# EAGLE design PIDDYBOT_V1_32U4 (EAGLE 8.3.0)
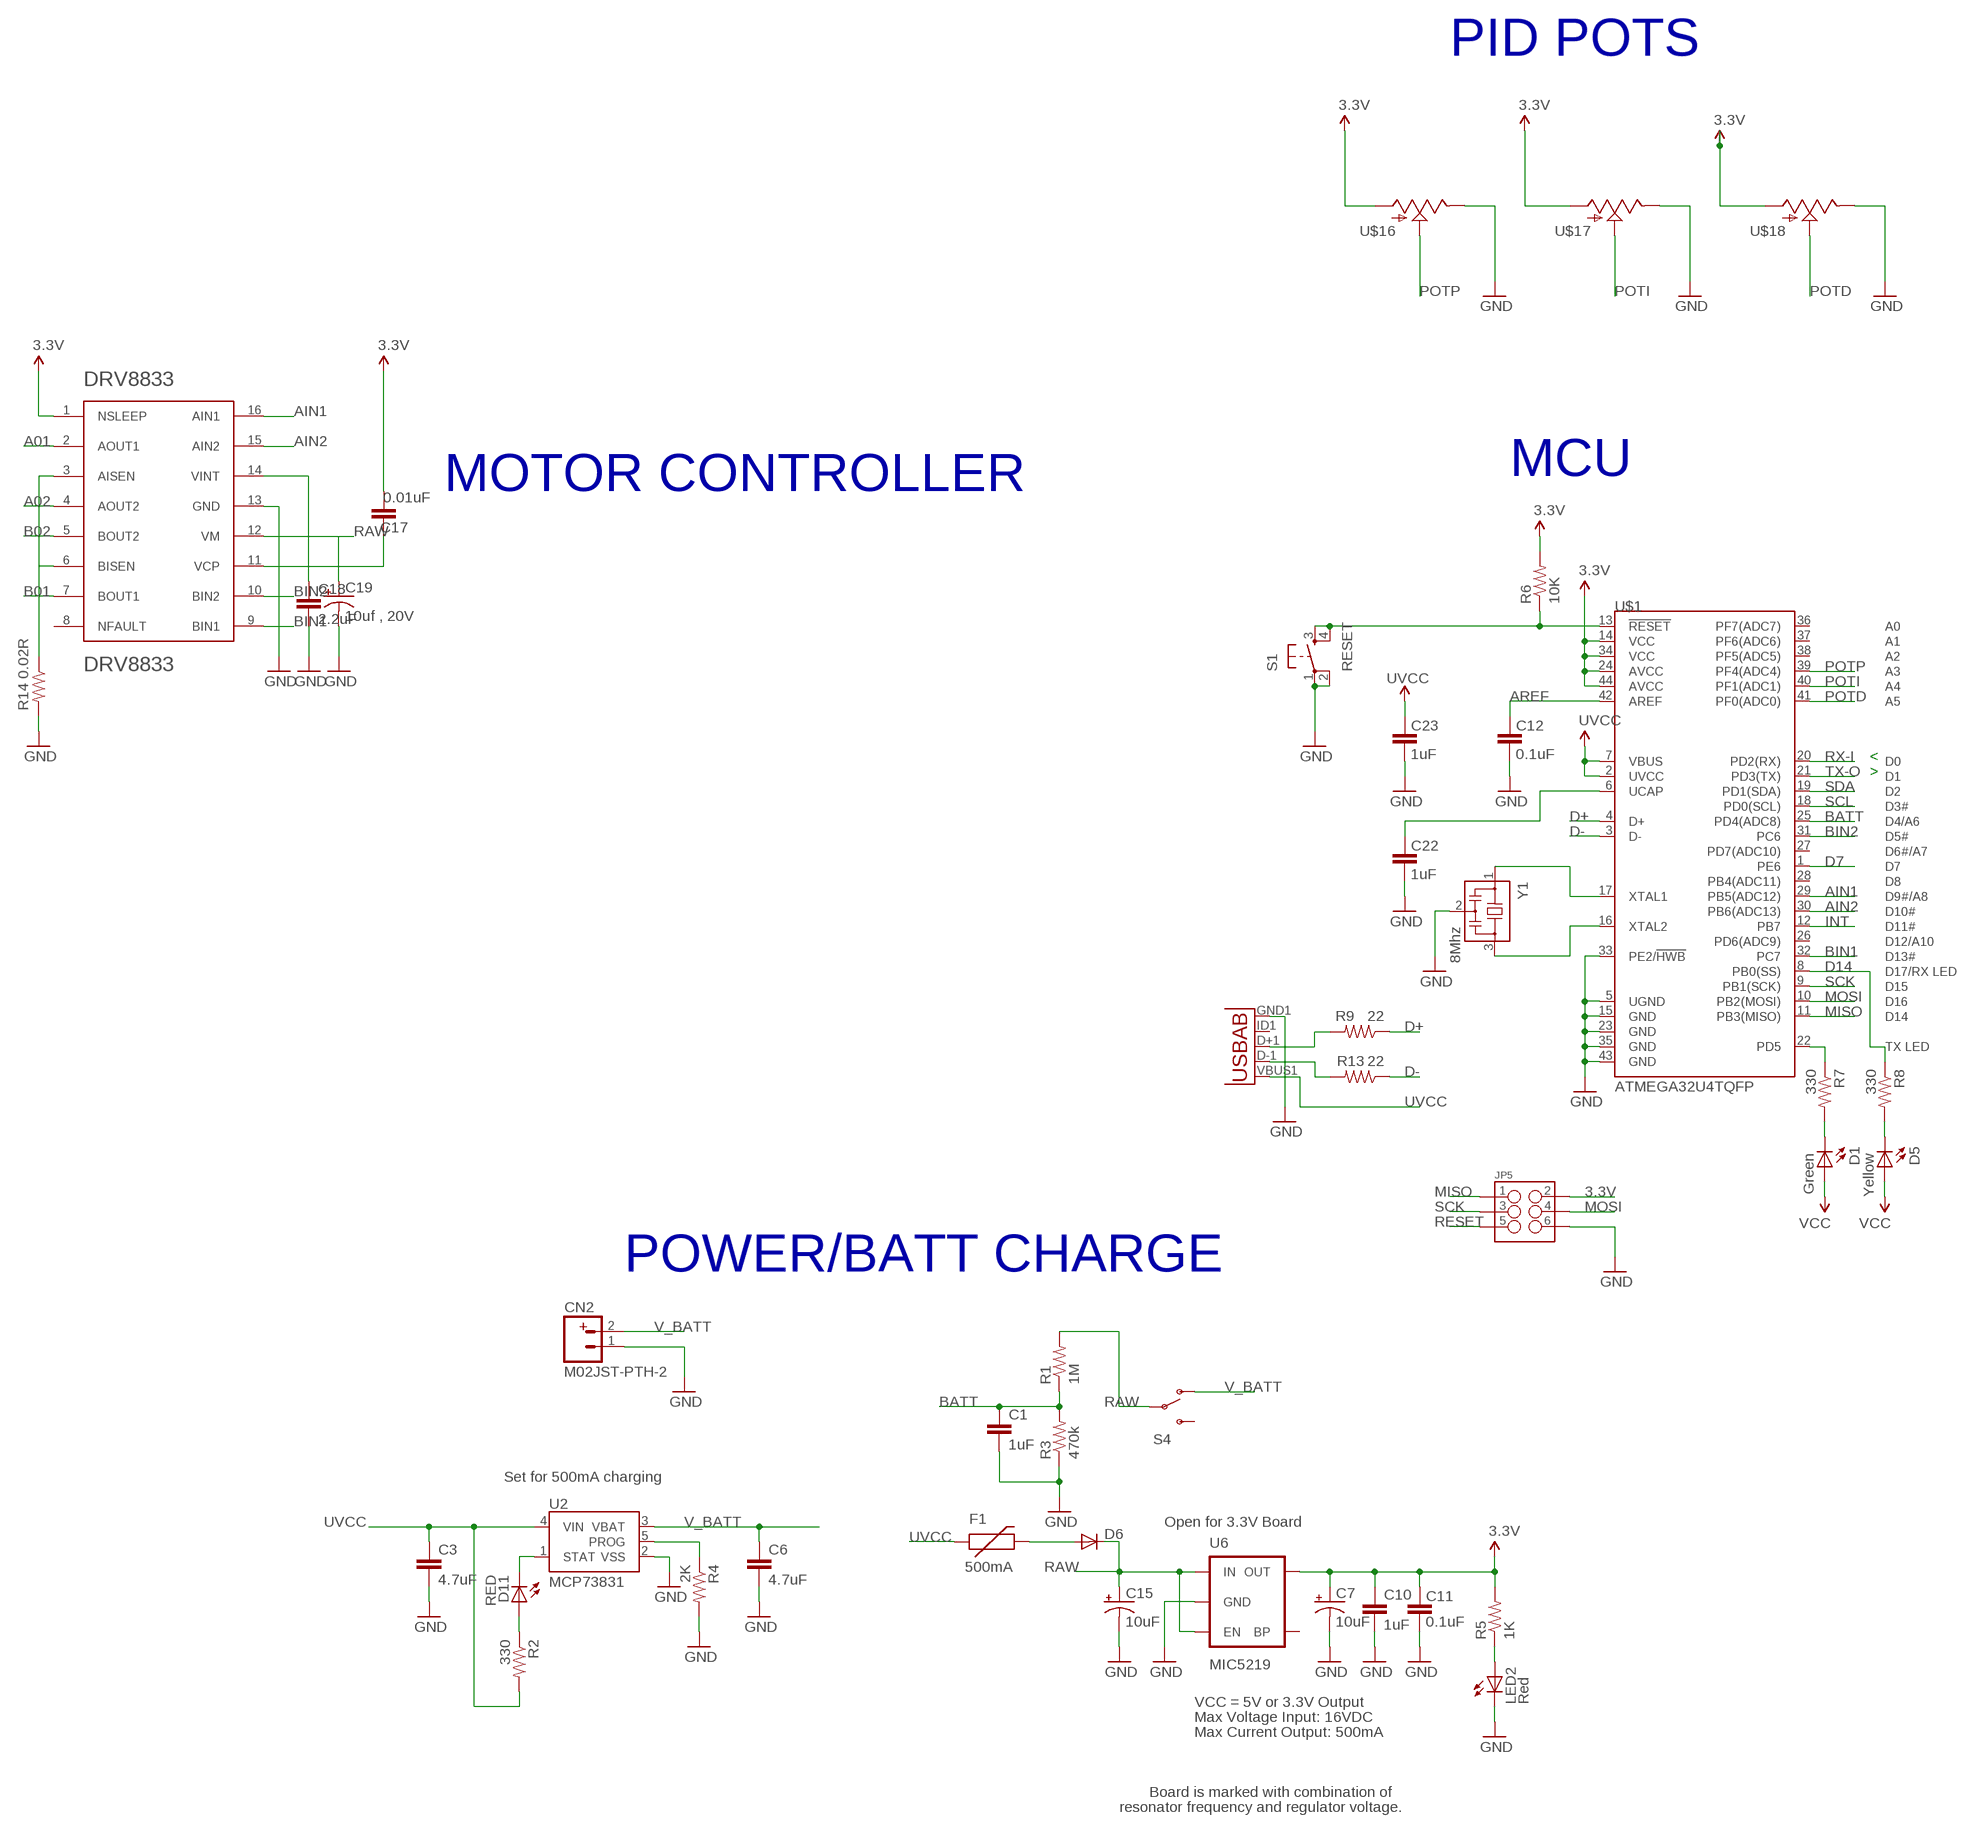
[diagram p0: schematic, sheet 1, part 1 of 2]
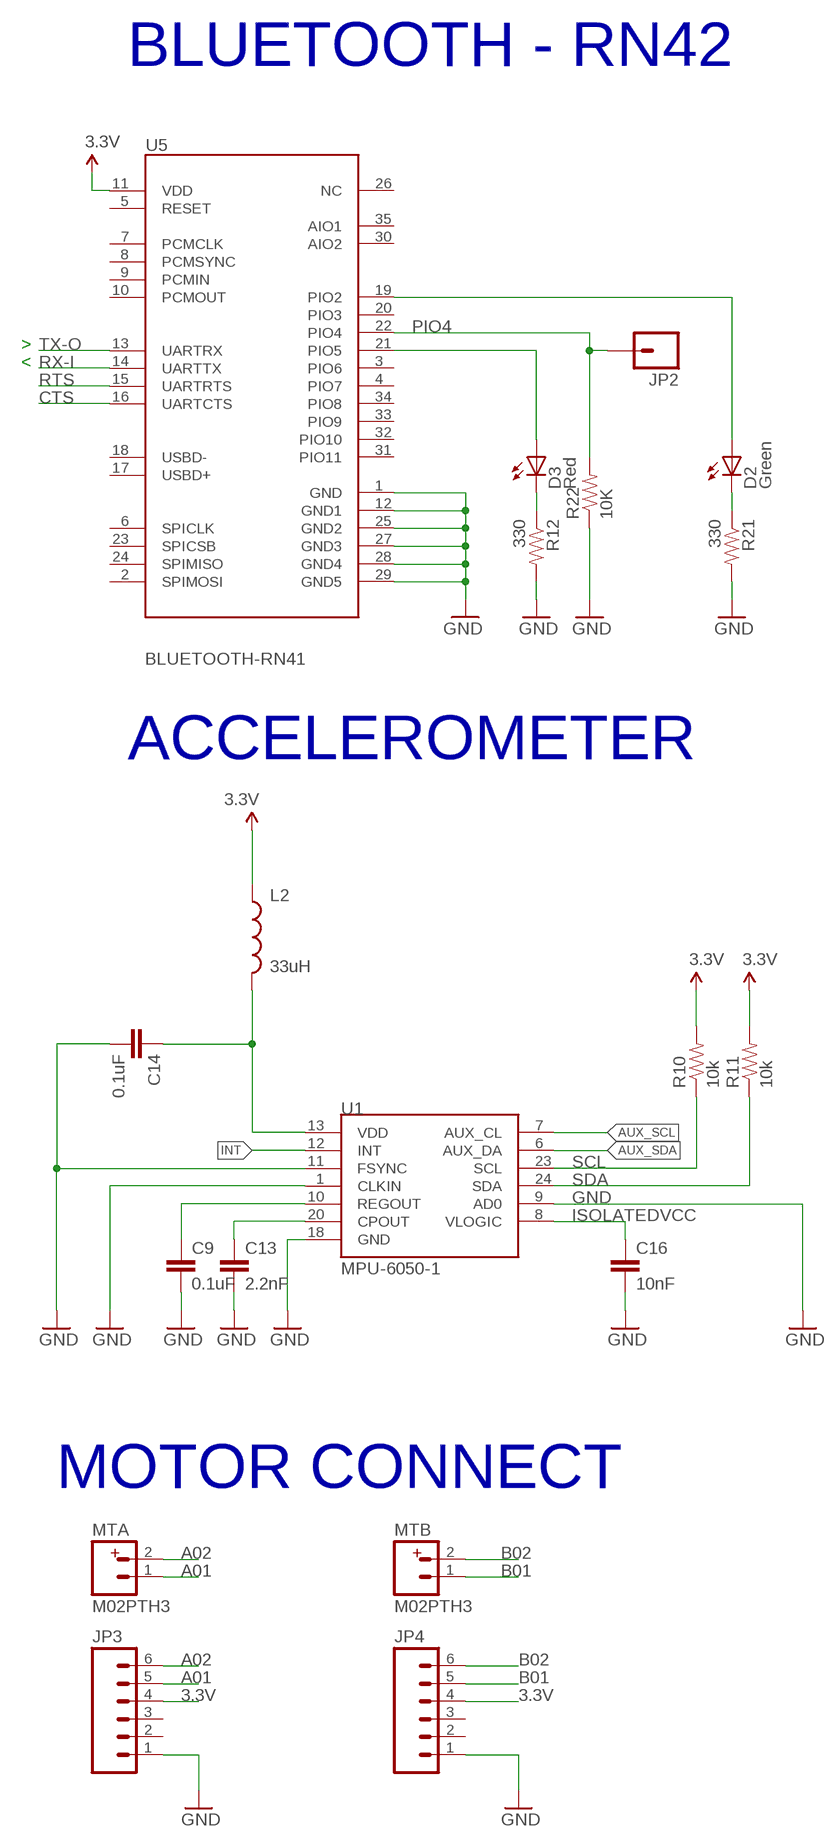
[diagram p1: schematic, sheet 1, part 2 of 2]

## Parts
C1  1uF  CAP0603-CAP  [0603-CAP]
C3  4.7uF  CAP0603-CAP  [0603-CAP]
C6  4.7uF  CAP0603-CAP  [0603-CAP]
C7  10uF  CAP_POL1206  [EIA3216]
C9  0.1uF  CAP0603-CAP  [0603-CAP]
C10  1uF  CAP0603-CAP  [0603-CAP]
C11  0.1uF  CAP0603-CAP  [0603-CAP]
C12  0.1uF  CAP0603-CAP  [0603-CAP]
C13  2.2nF  CAP0603-CAP  [0603-CAP]
C14  0.1uF  CAP0603-CAP  [0603-CAP]
C15  10uF  CAP_POL1206  [EIA3216]
C16  10nF  CAP0603-CAP  [0603-CAP]
C17  0.01uF  CAP0603-CAP  [0603-CAP]
C18  2.2uF  CAP0603-CAP  [0603-CAP]
C19  10uf , 20V  CAP_POL3528  [EIA3528]
C22  1uF  CAP0603-CAP  [0603-CAP]
C23  1uF  CAP0603-CAP  [0603-CAP]
CN2  M02JST-PTH-2  [JST-2-PTH]
D1  Green  LED0603  [LED-0603]
D2  Green  LED0603  [LED-0603]
D3  Red  LED0603  [LED-0603]
D5  Yellow  LED0603  [LED-0603]
D6  DIODESOD  [SOD-323]
D11  RED  LED0603  [LED-0603]
DRV8833PWP1  DRV8833  [SOP65P640X120-17N]
F1  500mA  PTCSMD  [PTC-1206]
JP2  M01SMDNS  [1X01NS]
JP3  M06SMD-1MM  [1X06-1MM]
JP4  M06SMD-1MM  [1X06-1MM]
JP5  M03X2NO_SILK  [2X3-NS]
L2  33uH  INDUCTOR0402  [C0402]
LED2  Red  LED0603  [LED-0603]
MTA  M02PTH3  [1X02_LONGPADS]
MTB  M02PTH3  [1X02_LONGPADS]
R1  1M  RESISTOR0603-RES  [0603-RES]
R2  330  RESISTOR0603-RES  [0603-RES]
R3  470k  RESISTOR0603-RES  [0603-RES]
R4  2K  RESISTOR0603-RES  [0603-RES]
R5  1K  RESISTOR0603-RES  [0603-RES]
R6  10K  RESISTOR0603-RES  [0603-RES]
R7  330  RESISTOR0603-RES  [0603-RES]
R8  330  RESISTOR0603-RES  [0603-RES]
R9  22  RESISTOR0603-RES  [0603-RES]
R10  10k  RESISTOR0603-RES  [0603-RES]
R11  10k  RESISTOR0603-RES  [0603-RES]
R12  330  RESISTOR0603-RES  [0603-RES]
R13  22  RESISTOR0603-RES  [0603-RES]
R14  0.02R  RESISTOR0603-RES  [0603-RES]
R21  330  RESISTOR0603-RES  [0603-RES]
R22  10K  RESISTOR0603-RES  [0603-RES]
S1  RESET  TAC_SWITCHSMD  [TACTILE_SWITCH_SMD]
S4  SWITCH-SPDTPTH  [SWITCH-SPDT]
U1  MPU-6050-1  [QFN-24-4MM2]
U2  MCP73831  [SOT23-5]
U5  BLUETOOTH-RN41  BLUETOOTH-RN41"  [RN41]
U6  MIC5219  V_REG_LDOSMD  [SOT23-5]
U$1  ATMEGA32U4TQFP  [SPARKFUN-DIGITALIC_TQFP44]
U$16  POT  [ALPS_POT]
U$17  POT  [ALPS_POT]
U$18  POT  [ALPS_POT]
X2  USB-ABIN&OUT  [USB-AB-MICRO-SMD-V03-IN&OUT]
Y1  8Mhz  CSTCR6M00G53Z  [CSTCR6M]

## Nets
3.3V: C7.A(+) C10.1 C11.2 C17.2 D1.A D5.A DRV8833PWP1.1(NSLEEP) JP3.4 JP4.4 JP5.2 L2.1 R5.2 R6.2 R10.2 R11.2 U5.11(VDD) U6.5(OUT) U$1.14(VCC) U$1.24(AVCC) U$1.34(VCC) U$1.44(AVCC) U$16.P$3(A) U$17.P$3(A) U$18.P$3(A) ; supply symbol labelled VCC
A01: DRV8833PWP1.2(AOUT1) JP3.5 MTA.1
A02: DRV8833PWP1.4(AOUT2) JP3.6 MTA.2
AIN1: DRV8833PWP1.16(AIN1) U$1.29(PB5(ADC12))
AIN2: DRV8833PWP1.15(AIN2) U$1.30(PB6(ADC13))
AREF: C12.2 U$1.42(AREF)
AUX_SCL: U1.7(AUX_CL)
AUX_SDA: U1.6(AUX_DA)
B01: DRV8833PWP1.7(BOUT1) JP4.5 MTB.1
B02: DRV8833PWP1.5(BOUT2) JP4.6 MTB.2
BATT: C1.1 R1.1 R3.2 U$1.25(PD4(ADC8))
BIN1: DRV8833PWP1.9(BIN1) U$1.32(PC7)
BIN2: DRV8833PWP1.10(BIN2) U$1.31(PC6)
CTS: U5.16(UARTCTS)
D1: D3.C R12.1
D2: D2.C R21.1
D7: U$1.1(PE6)
D14: R8.1 U$1.8(PB0(SS))
D+: R9.1 U$1.4(D+)
D-: R13.1 U$1.3(D-)
GND [vcc]: C1.2 C3.2 C6.2 C7.C(-) C9.2 C10.2 C11.1 C12.1 C13.2 C14.2 C15.C(-) C16.2 C18.2 C19.C(-) C22.1 C23.1 CN2.1 DRV8833PWP1.13(GND) JP3.1 JP4.1 JP5.6 LED2.C R3.1 R4.2 R12.2 R14.2 R21.2 R22.1 S1.1 S1.2 U1.1(CLKIN) U1.9(AD0) U1.11(FSYNC) U1.18(GND) U2.2(VSS) U5.1(GND) U5.12(GND1) U5.25(GND2) U5.27(GND3) U5.28(GND4) U5.29(GND5) U6.2(GND) U$1.5(UGND) U$1.15(GND) U$1.23(GND) U$1.33(PE2/!HWB) U$1.35(GND) U$1.43(GND) U$16.P$1(E) U$17.P$1(E) U$18.P$1(E) X2.GND1(GND) Y1.2
INT: U1.12(INT) U$1.12(PB7)
ISOLATEDVCC: C14.1 C16.1 L2.2 U1.8(VLOGIC) U1.13(VDD)
MISO: JP5.1 U$1.11(PB3(MISO))
MOSI: JP5.4 U$1.10(PB2(MOSI))
N$1: U$1.17(XTAL1) Y1.1
N$2: U$1.16(XTAL2) Y1.3
N$3: D6.2(A) F1.2
N$6: C13.1 U1.20(CPOUT)
N$7: C9.1 U1.10(REGOUT)
N$9: D3.A U5.21(PIO5)
N$11: D2.A U5.19(PIO2)
N$13: D11.A R2.1
N$15: C22.2 U$1.6(UCAP)
N$16: R13.2 X2.D-1(D-)
N$17: R9.2 X2.D+1(D+)
N$18: C17.1 DRV8833PWP1.11(VCP)
N$19: D5.C R8.2
N$20: D1.C R7.2
N$22: DRV8833PWP1.3(AISEN) DRV8833PWP1.6(BISEN) R14.1
N$24: C18.1 DRV8833PWP1.14(VINT)
N$38: LED2.A R5.1
PIO4: JP2.1 R22.2 U5.22(PIO4)
POTD: U$1.41(PF0(ADC0)) U$18.P$2(S)
POTI: U$1.40(PF1(ADC1)) U$17.P$2(S)
POTP: U$1.39(PF4(ADC4)) U$16.P$2(S)
PROG: R4.1 U2.5(PROG)
RAW: C15.A(+) C19.A(+) D6.1(C) DRV8833PWP1.12(VM) R1.2 S4.2(P) U6.1(IN) U6.3(EN)
RESET: JP5.5 R6.1 S1.3 S1.4 U$1.13(!RESET)
RTS: U5.15(UARTRTS)
RX-I: U5.14(UARTTX) U$1.20(PD2(RX))
SCK: JP5.3 U$1.9(PB1(SCK))
SCL: R10.1 U1.23(SCL) U$1.18(PD0(SCL))
SDA: R11.1 U1.24(SDA) U$1.19(PD1(SDA))
STAT: D11.C U2.1(STAT)
TX-O: U5.13(UARTRX) U$1.21(PD3(TX))
TXLED: R7.1 U$1.22(PD5)
UVCC: C3.1 C23.2 F1.1 R2.2 U2.4(VIN) U$1.2(UVCC) U$1.7(VBUS) X2.VBUS1(VBUS)
V_BATT: C6.1 CN2.2 S4.1(O) U2.3(VBAT)
Unconnected: DRV8833PWP1.8(NFAULT) JP3.2 JP3.3 JP4.2 JP4.3 S4.3(S) U5.2(SPIMOSI) U5.3(PIO6) U5.4(PIO7) U5.5(RESET) U5.6(SPICLK) U5.7(PCMCLK) U5.8(PCMSYNC) U5.9(PCMIN) U5.10(PCMOUT) U5.17(USBD+) U5.18(USBD-) U5.20(PIO3) U5.23(SPICSB) U5.24(SPIMISO) U5.26(NC) U5.30(AIO2) U5.31(PIO11) U5.32(PIO10) U5.33(PIO9) U5.34(PIO8) U5.35(AIO1) U6.4(BP) U$1.26(PD6(ADC9)) U$1.27(PD7(ADC10)) U$1.28(PB4(ADC11)) U$1.36(PF7(ADC7)) U$1.37(PF6(ADC6)) U$1.38(PF5(ADC5)) X2.ID1(USBID)

## Notes on the sheet
- BLUETOOTH - RN42
- PID POTS
- >
- <
- MOTOR CONTROLLER | MCU
- ACCELEROMETER
- <
- >
- MOTOR CONNECT
- POWER/BATT CHARGE
- Set for 500mA charging
- Open for 3.3V Board
- VCC = 5V or 3.3V Output
- Max Voltage Input: 16VDC
- Max Current Output: 500mA
- Board is marked with combination of
- resonator frequency and regulator voltage.

## Library data of the parts
C1 C3 C6 C9-C14 C16-C18 C22 C23 = SparkFun:CAP: Capacitor Standard 0603 ceramic capacitor, and 0.1" leaded capacitor.
C7 C15 C19 = SparkFun:CAP_POL: Capacitor Polarized These are standard SMD and PTH capacitors. Normally 10uF, 47uF, and 100uF in electrolytic and tantalum varieties. Always verify the external diameter of the through hole cap, it varies with capacity, voltage, and manufacturer. The EIA devices should be standard.
CN2 MTA MTB = SparkFun-Connectors:M02: Standard 2-pin 0.1" header. Use with - straight break away headers ( PRT-00116) - right angle break away headers (PRT-00553) - swiss pins (PRT-00743) - machine pins (PRT-00117) - female headers (PRT-00115) Molex polarized connector foot print use with: PRT-08233 with associated crimp pins and housings. 2.54_SCREWTERM for use with PRT-10571. 3.5mm Screw Terminal footprints for PRT-08084 5mm Screw Terminal footprints for use with PRT-08433
D1-D3 D5 D11 LED2 = SparkFun:LED: LEDs Standard schematic elements and footprints for 5mm, 3mm, 1206, and 0603 sized LEDs. 5mm - Spark Fun Electronics SKU : COM-00529 (and others)
D6 = SparkFun:DIODE: Diode These are standard reverse protection diodes and small signal diodes. SMA package can handle up to about 1A. SOD-323 can handle about 200mA. What the SOD-323 package when ordering, there are some mfgs out there that are 5-pin packages.
DRV8833PWP1 = DRV8833PWP:DRV8833
F1 = SparkFun:PTC: Resettable Fuse PTC Resettable Fuse. Spark Fun Electronics SKU : COM-08357
JP2 = SparkFun:M01: Header 1 Standard 1-pin 0.1" header. Use with straight break away headers (SKU : PRT-00116), right angle break away headers (PRT-00553), swiss pins (PRT-00743), machine pins (PRT-00117), and female headers (PRT-00115).
JP3 JP4 = SparkFun-Connectors:M06: Header 6 Standard 6-pin 0.1" header. Use with straight break away headers (SKU : PRT-00116), right angle break away headers (PRT-00553), swiss pins (PRT-00743), machine pins (PRT-00117), and female headers (PRT-00115). Molex polarized connector foot print use with SKU : PRT-08094 with associated crimp pins and housings. NOTES ON THE VARIANTS LOCK and LOCK_LONGPADS... This footprint was designed to help hold the alignment of a through-hole component (i.e. 6-pin header) while soldering it into place. You may notice that each hole has been shifted either up or down by 0.005 of an inch from it's more standard position (which is a perfectly straight line). This slight alteration caused the pins (the squares in the middle) to touch the edges of the holes. Because they are alternating, it causes a "brace" to hold the component in place. 0.005 has proven to be the perfect amount of "off-center" position when using our standard breakaway headers. Although looks a little odd when you look at the bare footprint, once you have a header in there, the alteration is very hard to notice. Also,if you push a header all the way into place, it is covered up entirely on the bottom side. This idea of altering the position of holes to aid alignment will be further integrated into the Sparkfun Library for other footprints. It can help hold any component with 3 or more connection pins.
JP5 = SparkFun-Connectors:M03X2: 2x3 .1" header. Shrouded, with keying- CONN-10681 SMT- CONN-11415 Pogo pins- HW-11044
L2 = SparkFun-Passives:INDUCTOR: Inductors Basic Inductor/Choke - 0603 and 1206. Footprints are not proven and vary greatly between part numbers. SRN6045- 33uH, 20% 1.4A SDR0403-560KL - 56uH, 10%, 500mA RMS/740mA peak
R1-R14 R21 R22 = SparkFun:RESISTOR: Resistor Basic schematic elements and footprints for 0603, 1206, and PTH resistors.
S1 = SparkFun:TAC_SWITCH: Momentary Switch Button commonly used for reset or general input. Spark Fun Electronics SKU : COM-00097
S4 = SparkFun-Electromechanical:SWITCH-SPDT: SPDT Switch Simple slide switch, Spark Fun Electronics SKU : COM-00102 DPDT SMT slide switch, AYZ0202, SWCH-08179
U1 = Testing:MPU-6050
U2 = SparkFun:MCP73831: Microchip's MCP73831 Miniature single cell, fully integrated Li-Ion, Li-polymer charge management controller http://ww1.microchip.com/downloads/en/DeviceDoc/21984a.pdf
U5 = ScratchPad:BLUETOOTH-RN41
U6 = SparkFun:V_REG_LDO: Voltage Regulator LDO Standard 150mA LDO voltage regulator in SOT-23 layout. Micrel part MIC5205. BP (by-pass) pin is used to lower output noise with 470pF cap.
U$1 = SparkFun-DigitalIC:ATMEGA32U4: Atmel 44-pin 8-bit Microcontroller with 32KBytes of ISP Flash and USB Controller ----- Please use the QFN-44-NOPAD_1:1 package for the footprint of all boards using a 32U4. Route traces directly away from the pads as much as possible.
U$16-U$18 = SparkFun-Electromechanical:POT
X2 = Testing:USB-AB: This is a USB AB connector that is compatible with USB OTG. i.e. this connector can serve as a host or device
Y1 = murata-filter:CSTCR: Resonator Source: murata.co.jp; MPN: CSTCR6M00G53-R0; OC_FARNELL: 1170434; OC_NEWARK: 25M8759

## Net classes
0 default: width 0.203 mm
1 vcc: width 0.254 mm

## Board
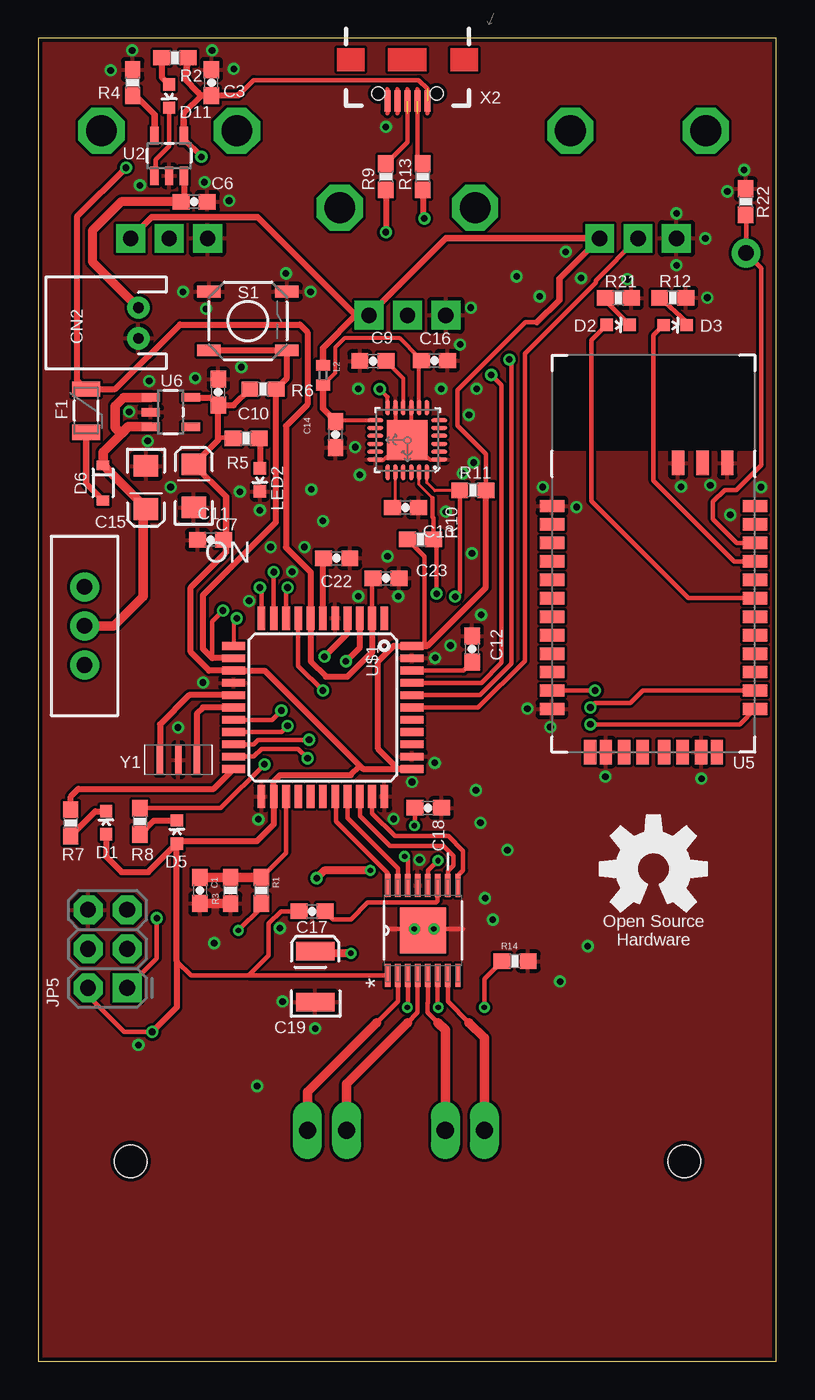
[diagram p2: board, top side]
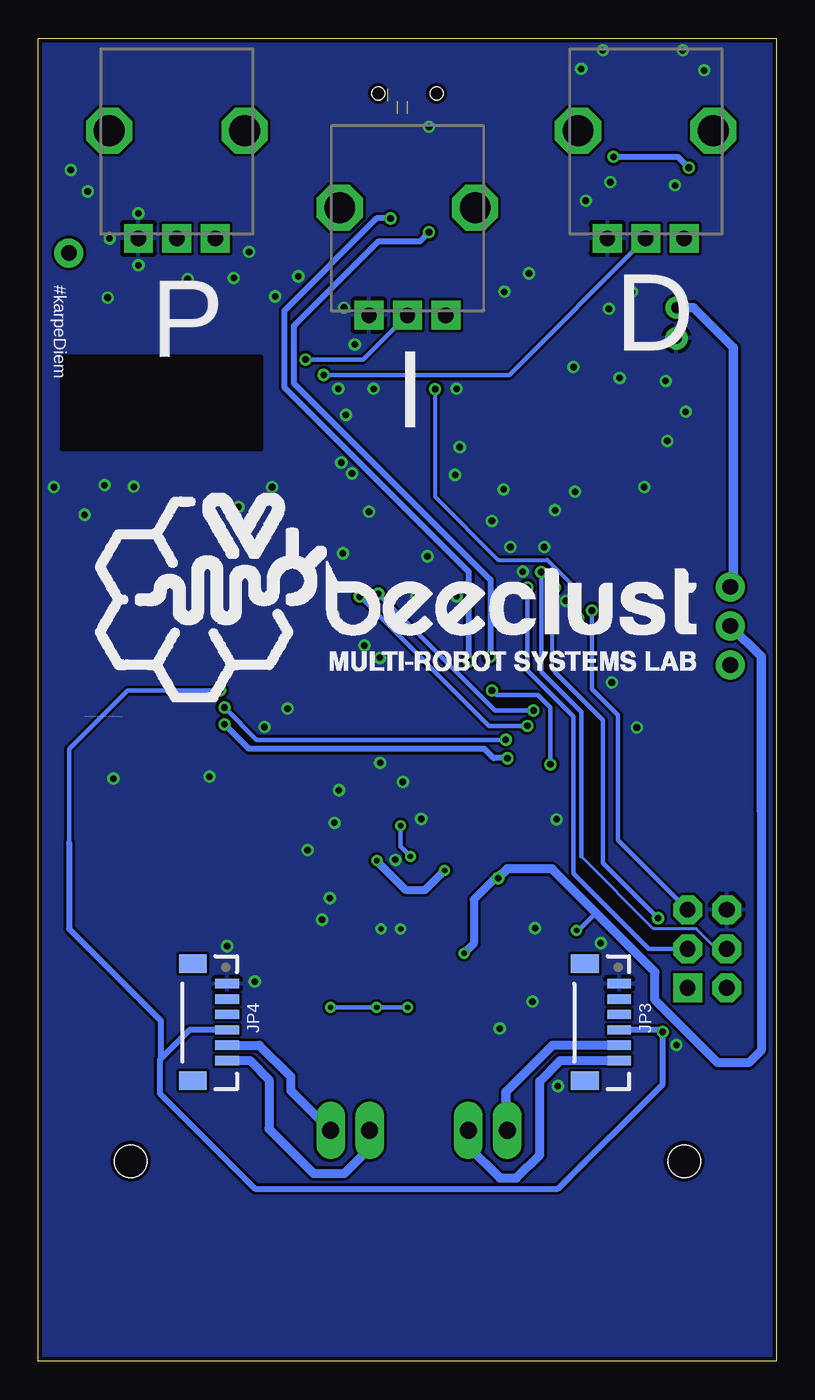
[diagram p3: board, bottom side, seen from below]

Size 48 x 86 mm. Coordinates in mm from the lower left corner, seen from the top.
Outline: 0,0 48,0 48,86 0,86 0,0
Copper layers (1*16): Top 0.0356mm / dielectric 1.5011mm / Bottom 0.0356mm
Design rules "LaenPCBOrder *": minimum track width 7mil, minimum drill 13mil, track to track 7mil, track to pad 7mil, pad to pad 7mil, via to via 7mil, smd to smd 7mil, copper to edge 10mil, drill to drill 7mil, minimum pad ring 7mil, minimum via ring 7mil, stop-mask expansion 3mil, vias tented up to drill 0mil, thermal gap 10mil
Holes 2.11 mm at 6,13 42,13

### Footprints (pad centres in the part's own frame; a part is rotated, then mirrored left to right if it is on the bottom)
0603-CAP = smd 1.1 x 1: 1 -0.85,0; 2 0.85,0
EIA3216 = smd 1.4 x 1.6: A 1.4,0; C -1.4,0
EIA3528 = smd 1.2 x 2.5: A 1.65,0; C -1.65,0
JST-2-PTH = drill 0.7 pad 1.448: 1 -1,0; 2 1,0
LED-0603 = smd 0.8 x 0.8: A 0,-0.75; C 0,0.75
SOD-323 = smd 0.63 x 0.83: 1 -1.15,0; 2 1.15,0
SOP65P640X120-17N = smd 1.473 x 0.356: 1 -2.921,2.286; 2 -2.921,1.626; 3 -2.921,0.965; 4 -2.921,0.33; 5 -2.921,-0.33; 6 -2.921,-0.965; 7 -2.921,-1.626; 8 -2.921,-2.286; 9 2.921,-2.286; 10 2.921,-1.626; 11 2.921,-0.965; 12 2.921,-0.33; 13 2.921,0.33; 14 2.921,0.965; 15 2.921,1.626; 16 2.921,2.286 | smd 2.997 x 2.997: 17 0,0
PTC-1206 = smd 1 x 1.8: 1 -1.4,0; 2 1.4,0
1X01NS = drill 1.016 pad 1.88: 1 0,0
1X06-1MM = smd 0.6 x 1.55: 1 -2.54,1.27; 2 -1.54,1.27; 3 -0.54,1.27; 4 0.46,1.27; 5 1.46,1.27; 6 2.46,1.27 | smd 1.2 x 1.8: P$1 -3.84,-0.955; P$2 3.76,-0.955
2X3-NS = drill 1.016 pad 1.88 square: 1 -2.54,-1.27 | drill 1.016 pad 1.88 octagon: 2 -2.54,1.27; 3 0,-1.27; 4 0,1.27; 5 2.54,-1.27; 6 2.54,1.27
C0402 = smd 0.7 x 0.9: 1 -0.65,0; 2 0.65,0
1X02_LONGPADS = drill 1.118 pad 1.88 long: 1 0,0; 2 2.54,0
0603-RES = smd 1.1 x 1: 1 -0.85,0; 2 0.85,0
TACTILE_SWITCH_SMD = smd 1.524 x 0.762: 1 -2.54,1.905; 2 2.54,1.905; 3 -2.54,-1.905; 4 2.54,-1.905
SWITCH-SPDT = drill 1.016 pad 1.88: 1 0,2.54; 2 0,0; 3 0,-2.54
QFN-24-4MM2 = smd 1.016 x 0.254: 1 -2.066,1.257; 2 -2.066,0.75; 3 -2.066,0.247; 4 -2.066,-0.287; 5 -2.066,-0.792; 6 -2.066,-1.297; 13 2.086,-1.297; 14 2.086,-0.792; 15 2.086,-0.287; 16 2.086,0.247; 17 2.086,0.75; 18 2.086,1.257 | smd 0.254 x 1.016: 7 -1.267,-2.122; 8 -0.762,-2.122; 9 -0.258,-2.122; 10 0.278,-2.122; 11 0.78,-2.122; 12 1.287,-2.122; 19 1.287,2.082; 20 0.78,2.082; 21 0.278,2.082; 22 -0.258,2.082; 23 -0.762,2.082; 24 -1.267,2.082 | smd 2.616 x 2.616: P$1 0.02,-0.01
SOT23-5 = smd 0.55 x 1.2: 1 -0.95,-1.3; 2 0,-1.3; 3 0.95,-1.3; 4 0.95,1.3; 5 -0.95,1.3
RN41 = smd 0.8 x 1.6: 1 -6.6,-6.6; 2 -5.4,-6.6; 3 -4.2,-6.6; 4 -3,-6.6; 5 -1.8,-6.6; 6 -0.6,-6.6; 7 0.6,-6.6; 8 1.8,-6.6; 9 3,-6.6; 10 4.2,-6.6; 11 5.4,-6.6; 12 6.6,-6.6; 13 6.6,6.6; 14 5.4,6.6; 15 4.2,6.6; 16 3,6.6; 17 1.8,6.6; 18 0.6,6.6; 19 -0.6,6.6; 20 -1.8,6.6; 21 -3,6.6; 22 -4.2,6.6; 23 -5.4,6.6; 24 -6.6,6.6 | smd 1.6 x 0.8: 25 -9.4,4.8; 26 -9.4,3.2; 27 -9.4,1.6; 28 9.4,3.1; 29 9.4,-3.1; 30 9.4,-4.122; 31 9.4,-1.9; 32 9.4,-0.7; 33 9.4,0.7; 34 9.4,1.9; 35 9.4,4.122
SPARKFUN-DIGITALIC_TQFP44 = smd 1.5 x 0.5: 1 -5.8,4; 2 -5.8,3.2; 3 -5.8,2.4; 4 -5.8,1.6; 5 -5.8,0.8; 6 -5.8,0; 7 -5.8,-0.8; 8 -5.8,-1.6; 9 -5.8,-2.4; 10 -5.8,-3.2; 11 -5.8,-4; 23 5.8,-4; 24 5.8,-3.2; 25 5.8,-2.4; 26 5.8,-1.6; 27 5.8,-0.8; 28 5.8,0; 29 5.8,0.8; 30 5.8,1.6; 31 5.8,2.4; 32 5.8,3.2; 33 5.8,4 | smd 0.5 x 1.5: 12 -4,-5.8; 13 -3.2,-5.8; 14 -2.4,-5.8; 15 -1.6,-5.8; 16 -0.8,-5.8; 17 0,-5.8; 18 0.8,-5.8; 19 1.6,-5.8; 20 2.4,-5.8; 21 3.2,-5.8; 22 4,-5.8; 34 4,5.8; 35 3.2,5.8; 36 2.4,5.8; 37 1.6,5.8; 38 0.8,5.8; 39 0,5.8; 40 -0.8,5.8; 41 -1.6,5.8; 42 -2.4,5.8; 43 -3.2,5.8; 44 -4,5.8
ALPS_POT = drill 1 pad 1.88 square: P$1 7,-2.5; P$2 7,0; P$3 7,2.5 | drill 2 octagon: P$4 0,-4.4; P$5 0,4.4
USB-AB-MICRO-SMD-V03-IN&OUT = smd 1.4 x 0.4: D+1 2.7,0; D-1 2.7,0.65; GND1 2.7,-1.3; ID1 2.7,-0.65; VBUS1 2.7,1.3 | hole 0.85: 2.2,1.9; 2.2,-1.9
CSTCR6M = smd 0.4 x 2: 1 -1.2,0; 2 0,0; 3 1.2,0

### Placement (x,y rotation side)
C1  10.5,30.6 270 top
C3  11.25,83.12 90 top
C6  10.12,75.38 0 top
C7  10.1,56.9 90 top
C9  21.75,65.03 180 top
C10  11.7,63 90 top
C11  11.2,53.4 0 top
C12  28.2,46.3 270 top
C13  23.88,55.5 0 top
C14  19.32,60.25 270 top
C15  7,56.8 270 top
C16  25.75,65.05 0 top
C17  17.8,29.25 180 top
C18  25.35,35.97 0 top
C19  18,25 90 top
C22  19.4,52.2 180 top
C23  22.6,50.9 180 top
CN2  6.5,67.5 90 top
D1  4.4,35 0 top
D2  37.7,67.37 270 top
D3  41.4,67.36 270 top
D5  9,34.4 0 top
D6  4.2,57.1 270 top
D11  8.5,82.25 180 top
DRV8833PWP1  25,28 90 top
F1  3.1,61.8 270 top
JP2  46.02,72.05 0 top
JP3  11.5,22 270 bottom
JP4  37,22 270 bottom
JP5  4.5,26.8 90 top
L2  18.5,64.1 270 top
LED2  14.4,57.3 180 top
MTA  17.5,15 0 top
MTB  29,15 180 top
R1  14.5,30.6 270 top
R2  8.88,84.75 0 top
R3  12.5,30.59 90 top
R4  6.12,83.12 90 top
R5  13.5,60 180 top
R6  14.6,63.2 180 top
R7  2.1,35 270 top
R8  6.6,35.1 270 top
R9  22.6,77 90 top
R10  24.85,53.42 180 top
R11  28.25,56.62 0 top
R12  41.25,69.13 0 top
R13  25,77 90 top
R14  31,26 0 top
R21  37.71,69.12 0 top
R22  46,75.38 270 top
S1  13.62,67.62 0 top
S4  3,47.8 0 top
U1  24,59.88 180 top
U2  8.5,78.38 0 top
U5  40,49 270 top
U6  8.6,61.7 270 top
U$1  18.5,42.5 270 top
U$2  [LOGO-L]  45,42 0 bottom
U$3  [OSHW-LOGO-L]  40,32 0 top
U$16  39,80 270 bottom
U$17  24,75 270 bottom
U$18  8.5,80 270 bottom
X2  24,84.62 270 top
Y1  9.1,39.1 180 top

### Tracks (layer width: path | path; a pad name or v marks a point on that pad's centre or on a via)
3.3V  (via drill 0.43)
  Top 0.3: R11.2 29.1,58.98 27.25,60.83 27.25,63.12 31.69,67.56 32.44,67.56 | v36.2,43.6 U5.11 | v7.4,21.4 5.59,21.4 3.23,23.76 JP5.2 | 25.1,51.2 25.1,46.5
  Top 0.305: 12.7,60.05 11.7,60.05 11.7,59.9 | 25.1,51.2 25.1,52.33 R10.2 | 13.66,25.08 DRV8833PWP1.1 | 13.66,25.08 9.92,25.08 9,26 | C17.2 15.78,29.25 14.98,28.45 14.98,26.39 13.66,25.08
  Top 0.4: 13.6,63.05 R6.2 12.7,62.15 C10.1 | U6.5 11.2,62.65 C10.1 | 12.7,60.05 R5.2 | C10.1 11.7,59.9 C7.A 12.2,56.2 | 12.2,52.6 9.9,50.3 9.9,46.1 11.1,44.9 U$1.14 14.7,44.9 20.9,38.7 | 20.9,38.7 21.1,38.5 U$1.34 | D5.A 9.15,33.8 14.2,33.8 15.3,34.9 U$1.24 15.3,37.7 15.7,38.1 20.3,38.1 20.9,38.7 | D1.A 4.4,32.8 5.4,31.8 7.15,31.8 D5.A | D5.A 9,26 9,23 v7.4,21.4 | U$1.34 23.4,38.5 22.1,39.8 22.1,45.5 23.1,46.5 U$1.44 25.1,46.5 25.3,46.5 29.1,50.3 R11.2 | U$1.34 24.8,38.5
  Top 0.406: 20.62,68 U$17.P$3 26.5,73 U$16.P$3 33.88,70.38 33.88,69 32.44,67.56 | 20.62,68 14.25,74.38 7.38,74.38 U$18.P$3 | 20.62,68 18.5,65.88 L2.1 | 12.2,56.2 12.2,53.55 C11.2 12.2,53.25 12.2,52.6
  Bottom 0.3: 46,33.71 46,39.8 42.2,43.6 v36.2,43.6
  Bottom 0.4: JP3.4 7.54,21.54 v7.4,21.4 7.4,18 14.2,11.2 33.9,11.2 40.1,17.4 40.1,19.6 40.05,19.65 | JP4.4 38.16,21.54 40.05,19.65 | 46,33.71 46,28.1 40.05,22.15 40.05,19.65
A01
  Top 0.305: DRV8833PWP1.2 23.37,23.37 22,22
  Top 0.61: MTA.1 17.5,17.5 22,22
  Bottom 0.6: JP3.5 14.56,20.54 17.59,17.51 | 17.59,15.09 MTA.1
  Bottom 0.61: 17.59,17.51 17.59,15.09
A02
  Top 0.305: 20,16 20,15.04 MTA.2 | DRV8833PWP1.4 24.67,22.67 | 24.67,23 24.67,22.67 | 24,22 24.67,22.67
  Top 0.61: MTA.2 20.04,18.04 24,22
  Bottom 0.6: MTA.2 20.04,13.94 18,11.9 16.9,11.9 15.4,13.4 15.4,18.2 14.06,19.54 JP3.6
AIN1
  Top 0.305: DRV8833PWP1.16 22.71,31.74 19.37,35.08 19.37,36.63 U$1.29
AIN2
  Top 0.305: DRV8833PWP1.15 23.37,32.03 20.1,35.3 U$1.30
AREF
  Top 0.3: U$1.42 27.65,44.9 C12.2
B01
  Top 0.305: DRV8833PWP1.7 26.63,23.37 28,22
  Top 0.61: MTB.1 29,21 28,22
  Bottom 0.6: JP4.5 33.64,20.54 31.6,18.5 31.6,17.6 MTB.1
B02
  Top 0.305: DRV8833PWP1.5 25.33,23.3 25.32,23.28 25.32,22.68 26,22
  Top 0.61: MTB.2 26.46,21.54 26,22
  Bottom 0.6: JP4.6 34.24,19.54 33,18.3 33,15.1 30.1,12.2 28.1,12.2 26.46,13.84 MTB.2
BATT
  Top 0.305: U$1.25 16.1,33.05 R1.1
  Top 0.61: R1.1 R3.2 C1.1
BIN1
  Top 0.305: U$1.32 21.7,35.61 23.18,34.13 26.67,34.13 27.62,33.18 27.62,31.91 27.29,31.57 DRV8833PWP1.9
BIN2
  Top 0.305: U$1.31 20.9,35.45 22.86,33.5 26.35,33.5 26.99,32.86 26.99,32.23 26.63,31.86 DRV8833PWP1.10
D1
  Top 0.3: D3.C 42.15,67.59 R12.1
D2
  Top 0.3: D2.C 37.06,68.76 R21.1
D14  (via drill 0.43)
  Top 0.3: R8.1 11.85,35.95 v14.7,38.8 | v18.5,43.6 16.9,45.2 U$1.8
  Bottom 0.3: v14.7,38.8 14.7,42.5 15.5,43.3 18.2,43.3 v18.5,43.6
D+  (via drill 0.43)
  Top 0.4: R9.1 v22.6,73.4 | v18.6,45.8 20.1,47.3 U$1.4
  Bottom 0.4: v22.6,73.4 23.2,72.8 25.9,72.8 31.4,67.3 31.4,63.6 18.6,50.8 v18.6,45.8
D-  (via drill 0.43)
  Top 0.4: R13.1 25,74.4 v25.1,74.3 | v20,45.5 20.9,46.4 U$1.3
  Bottom 0.4: v25.1,74.3 26,74.3 32,68.3 32,63.3 20,51.3 v20,45.5
GND  (via drill 0.35, 0.43)
  Top 0.254: U1.11 23.22,61.18 23.7,60.7 23.9,60.7 24.26,61.06 U1.9 | 22.8,58.9 22.4,58.6 21.9,58.6 U1.18 | 26.08,58.6 25.5,58.6 25.1,58.9 | 26.1,58.6 26.08,58.6 | 26.08,58.6 U1.1
  Top 0.305: 22.86,28.1 v24.45,28.1 v25.72,28.1 27.62,28.1
  Top 0.61: C1.2 R3.1
  other vias: 24.3,37.65 20.6,59.42 27.43,66.1 36.88,38 43.12,37.88 28.75,35 15.88,23.38 18,21.62 15.7,28.15 28.12,68.5 41.5,74.62 43.38,73 41.5,71.25 17.75,56.67 9.4,69.53 10.9,68.42 16.1,70.72 17.7,69.53 35,55.52 45,55.02 47,56.83 32.8,56.83 31.8,42.42 33.3,41.23 28.8,48.52 26.8,46.52 28.46,37.12 30.5,33.23 29.55,28.7 29.05,30.1 6.5,20.55 23.4,49.73 22.7,52.33 20.8,49.73 14.3,35.23 8.6,56.83 7.1,59.83 7.2,63.73 12.7,84.03 11.3,85.22 6.1,85.22 4.7,83.92 20.8,63.23 26.2,63.23 31.1,70.53 32.6,69.22 34.3,72.12 35.3,70.42 28.5,63.23 28,61.52 10.2,63.92 13.2,64.62 5.9,61.73 14.4,55.33 13.1,56.52 38.3,70.35 43.5,69.15 44.8,76.05 45.9,77.45 22.6,80.25 6.6,76.45 10.8,76.65 12.4,75.45 35.73,26.98 33.92,24.68 11.43,27.18 9.07,41.2 25.77,38.9 14.22,17.88 17.3,52.92 15.1,52.92 25.8,45.73 10.7,44.12 23.1,35.25 28.3,58.42 27.6,57.73 43.7,56.95 41.8,56.85 13.7,49.42 16.5,51.33 18.5,54.62 26.5,55.23 28.2,52.52 20.9,57.62 24.79,32.59
  pour Bottom: 0,86 0,0 48,0 48,86
  pour Top: 0,86 0,0 48,0 48,86
INT  (via drill 0.43)
  Top 0.254: U1.12 22.71,62.69 v22.2,63.2 | U$1.12 12.7,48.1 v12.9,48.3
  Bottom 0.254: v22.2,63.2 22.2,56.2 18.1,52.1 14.9,52.1 12.9,50.1 v12.9,48.3
ISOLATEDVCC
  Top 0.254: 24.9,65.1 C16.1 24.76,64.91 | 19.4,61.17 U1.13 | 24.76,64.91 24.76,65.24 23.5,66.5 19.9,66.5 19.3,65.9 19.3,64.25 L2.2 | U1.8 24.76,64.91
  Top 0.406: L2.2 18.5,61.92 C14.1
  Top 0.61: 19.4,61.17 C14.1
MISO  (via drill 0.43)
  Top 0.3: U$1.11 14.5,50.2 v14.4,50.3 | v7.7,28.8 7.7,26.19 JP5.1
  Bottom 0.254: v14.4,50.3 14.4,50.2 14.6,50 14.6,45 14.4,44.8
  Bottom 0.3: 14.4,44.8 11.3,41.7 11.3,32.4 v7.7,28.8
MOSI  (via drill 0.43)
  Top 0.3: U$1.10 v15.3,51.3
  Bottom 0.2: JP5.4 3.9,26.8 5.2,28.1 8,28.1 12.7,32.8
  Bottom 0.3: v15.3,51.3 15.3,44.8 12.7,42.2 12.7,32.8
N$1
  Top 0.4: U$1.17 10.7,42.5 10.3,42.1 Y1.1
N$2
  Top 0.4: U$1.16 9.8,43.3 7.9,41.4 Y1.3
N$3
  Top 0.406: F1.2 3.1,57.05 D6.2
N$5
  cutout Bottom: 33.5,65.3 46.5,65.3 46.5,59.3 33.5,59.3
  cutout Top: 33.5,65.3 46.5,65.3 46.5,59.3 33.5,59.3
N$6
  Top 0.2: U1.20 23.22,55.7 C13.1
N$7
  Top 0.254: C9.1 23.72,63.9 U1.10
N$9
  Top 0.3: U5.21 45.25,52 40,57.25 40,66.71 D3.A
N$11
  Top 0.3: U5.19 42.27,49.6 35.95,55.92 35.95,66.37 D2.A
N$13
  Top 0.4: R2.1 8.03,83.47 D11.A
N$15
  Top 0.4: U$1.6 18.5,52.15 C22.2
N$16  (1 unrouted)
  Top 0.3: 24.65,81.12 24.65,78.2 R13.2
  Top 0.4: 24.85,78 R13.2
N$17  (1 unrouted)
  Top 0.3: 24,81.12 24,79.25 R9.2
  Top 0.4: R9.2 22.6,78.22
N$18
  Top 0.305: DRV8833PWP1.11 25.96,29.93 25.86,29.83 21.42,29.83 20.32,28.73 19.17,28.73 C17.1
N$19
  Top 0.4: R8.2 7.5,35.15 D5.C
N$20
  Top 0.4: R7.2 3.7,35.75 D1.C
N$22  (via drill 0.35)
  Top 0.305: v29,23 29,24.85 R14.1 | DRV8833PWP1.6 25.96,23.04 v26,23 | DRV8833PWP1.3 24.04,23.05 v23.99,23
  Bottom 0.305: v29,23 v26,23 v23.99,23
N$24  (via drill 0.35)
  Top 0.305: C18.1 24.5,34.87 v24.45,34.81 | DRV8833PWP1.14 24.04,32.59 v23.81,32.81
  Bottom 0.305: v24.45,34.81 24.45,33.45 v23.81,32.81
N$38
  Top 0.4: R5.1 14.4,59.95 LED2.A
PIO4
  Top 0.3: U5.22 45.42,53.2 43.88,54.75 43.88,55.88 44.62,56.62 45.38,56.62 47,58.25 47,71.08 JP2.1 46.02,74.7 R22.2
POTD  (via drill 0.43)
  Top 0.3: v29.45,64.12 30.12,63.45 30.12,45.42 28.8,44.1 U$1.41
  Bottom 0.3: v29.45,64.12 17.38,64.12 U$18.P$2
POTI  (via drill 0.43)
  Top 0.3: 30.62,65 v30.62,65.12 30.75,65 30.75,45.35 28.7,43.3 U$1.40
  Bottom 0.3: v30.62,65.12 26.88,65.12 U$17.P$2
POTP
  Top 0.3: U$16.P$2 36.25,70.25 36.25,70.12 31.62,65.5 31.62,45.52 28.6,42.5 U$1.39
PROG
  Top 0.4: R4.1 6.33,82.28 7.55,81.05
  Top 0.406: 7.55,81.05 U2.5
RAW  (via drill 0.35, 0.43)
  Top 0.305: R1.2 14.5,29.5 v13,28 | DRV8833PWP1.12 25.33,31.89 v25.99,32.54
  Top 0.508: v21.58,31.9 18.6,31.9 v18.1,31.4 | v20.32,26.51 18.14,26.51 C19.A
  Top 0.61: 5.4,60.3 4.2,59.1 D6.1 7,55.45 C15.A 6.8,55.2 6.8,49.7 4.9,47.8 S4.2 | 5.4,60.3 5.85,60.75 U6.3 | U6.1 5.55,62.65 5,62.1 5,60.7 5.4,60.3
  Bottom 0.305: v13,28 12.88,28 11.74,29.14
  Bottom 0.508: v25.99,32.54 25.99,32.49 24.13,30.64 22.85,30.64 v21.58,31.9 | v18.1,31.4 18.29,31.4 19.68,30 19.68,27.14 v20.32,26.51
  Bottom 0.6: 1,35.8 1,20.2 1.8,19.4 3.8,19.4 7.9,23.5 7.9,25.3 11.74,29.14 14.6,32 17.5,32 v18.1,31.4
  Bottom 0.61: 1,35.8 1,45.8 S4.2
RESET  (via drill 0.43)
  Top 0.3: 11.3,45.7 11.3,48.1 v12,48.8
  Top 0.4: S1.3 S1.4 16.16,63.91 R6.1 15.45,54.55 10.7,49.8 10.7,46.3 11.3,45.7 U$1.13
  Bottom 0.3: v12,48.8 12,43.7 10.3,42 10.3,33.87 JP5.5
RX-I  (via drill 0.43)
  Top 0.3: U$1.20 14,40.1 14.3,40.4 v17.6,40.4 | v35.9,42.5 36.2,42.8 38.5,42.8 39.3,43.6 U5.14
  Bottom 0.3: v17.6,40.4 33.8,40.4 v35.9,42.5
SCK  (via drill 0.43)
  Top 0.3: U$1.9 16.1,50.2 v16.2,50.3
  Bottom 0.3: v16.2,50.3 16.2,44.9 13.2,41.9 13.2,31.7 8.3,26.8 JP5.3
SCL  (via drill 0.43)
  Top 0.2: 25.62,56.12 24.75,57 U1.23
  Top 0.3: 25.62,54.88 25.62,56.12 | U$1.18 15.2,41.7 v15.8,42.3
  Top 0.305: v25.9,49.9 25.9,53.23 R10.1 25.7,54.8 25.62,54.88
  Bottom 0.3: v15.8,42.3 18.3,42.3 v25.9,49.9
SDA  (via drill 0.43)
  Top 0.2: U1.24 25.27,57.11 25.77,56.6 27.38,56.6 R11.1
  Top 0.3: U$1.19 15.8,40.9 v16.2,41.3 | v27.1,49.7 27.4,50 R11.1
  Bottom 0.3: v16.2,41.3 18.7,41.3 v27.1,49.7
STAT
  Top 0.305: U2.1 7.62,77.08 7.62,78.12 8.5,79 D11.C
TX-O  (via drill 0.43)
  Top 0.3: U$1.21 14,39.3 14.5,39.8 16.9,39.8 v17.5,39.2 | 46.4,42.2 U5.13 45.6,41.4 v35.9,41.4
  Bottom 0.4: v17.5,39.2 18.4,39.2 19,39.8 34.3,39.8 v35.9,41.4
TXLED
  Top 0.4: R7.1 2.1,36.7 2.6,37.2 11.4,37.2 U$1.22
UVCC  (via drill 0.43)  (1 unrouted)
  Top 0.3: 11.43,82.3 C3.1 | C23.2 21.7,50.85 U$1.2 | 13.18,82.47 14,83.3 24.73,83.3 25.3,82.73
  Top 0.4: U2.4 9.45,79.45 v10.6,78.3 | v5.7,77.6 2.5,74.4 2.5,63.8 F1.1 5,63.2 9.2,67.4 17,67.4 17.5,66.9 17.5,62.2 16.1,60.8 16.1,52.9 17.7,51.3 U$1.7 17.7,45.5 18.7,44.5 20.1,44.5 21.7,46.1 U$1.2 | C3.1 10.6,82.28 | 10.6,82.28 10.4,82.47 | 11.43,82.3 13,82.3 13.18,82.47 | 9.45,80.67 9.45,81.12 10.6,82.28
  Top 0.406: 9.45,80.67 U2.4 | 10.4,82.47 9.53,83.35 R2.2
  Bottom 0.4: v10.6,78.3 6.4,78.3 v5.7,77.6
V_BATT
  Top 0.4: 9.47,77.05 9.47,75.58 C6.1
  Top 0.406: U2.3 9.47,77.05
  Top 0.6: C6.1 5.38,75.38 3.5,73.5 3.5,71.5 CN2.2
  Bottom 0.61: CN2.2 5.4,68.5 2.8,65.9 2.8,50.54 S4.1

### Text on the board
tPlace: Open Source / Hardware
bPlace: #karpeDiem
tNames: ON
bNames: D | P | I